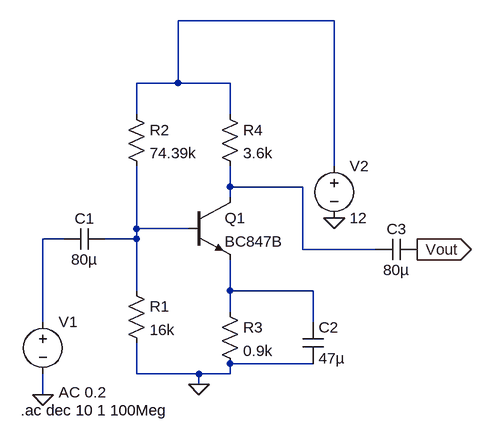
[diagram p0: schematic exp-5electro.asc]
exp-5electro.asc, the LTspice schematic file:
Version 4
SHEET 1 880 680
WIRE 432 -240 192 -240
WIRE 192 -144 192 -240
WIRE 192 -144 128 -144
WIRE 272 -144 192 -144
WIRE 128 -96 128 -144
WIRE 272 -96 272 -144
WIRE 432 -16 432 -240
WIRE 272 16 272 -16
WIRE 384 16 272 16
WIRE 272 32 272 16
WIRE 128 80 128 -16
WIRE 208 80 128 80
WIRE 16 96 -16 96
WIRE 128 96 128 80
WIRE 128 96 80 96
WIRE 384 112 384 16
WIRE 496 112 384 112
WIRE 128 176 128 96
WIRE 272 176 272 128
WIRE 400 176 272 176
WIRE 272 208 272 176
WIRE -16 224 -16 96
WIRE 400 224 400 176
WIRE 400 288 272 288
WIRE 128 304 128 256
WIRE 224 304 128 304
WIRE 272 304 272 288
WIRE 272 304 224 304
WIRE 224 320 224 304
WIRE -16 336 -16 304
FLAG 224 320 0
FLAG -16 336 0
FLAG 560 112 Vout
IOPIN 560 112 Out
FLAG 432 64 0
SYMBOL res 112 160 R0
SYMATTR InstName R1
SYMATTR Value 16k
SYMBOL res 112 -112 R0
SYMATTR InstName R2
SYMATTR Value 74.39k
SYMBOL res 256 192 R0
SYMATTR InstName R3
SYMATTR Value 0.9k
SYMBOL cap 384 224 R0
SYMATTR InstName C2
SYMATTR Value 47µ
SYMBOL res 256 -112 R0
SYMATTR InstName R4
SYMATTR Value 3.6k
SYMBOL voltage 432 -32 R0
WINDOW 123 0 0 Left 0
WINDOW 39 0 0 Left 0
SYMATTR InstName V2
SYMATTR Value 12
SYMBOL cap 560 96 R90
WINDOW 0 0 32 VBottom 2
WINDOW 3 32 32 VTop 2
SYMATTR InstName C3
SYMATTR Value 80µ
SYMBOL npn 208 32 R0
SYMATTR InstName Q1
SYMATTR Value BC847B
SYMBOL voltage -16 208 R0
WINDOW 123 24 124 Left 2
WINDOW 39 0 0 Left 0
SYMATTR InstName V1
SYMATTR Value ""
SYMATTR Value2 AC 0.2
SYMBOL cap 80 80 R90
WINDOW 0 0 32 VBottom 2
WINDOW 3 32 32 VTop 2
SYMATTR InstName C1
SYMATTR Value 80µ
TEXT -50 360 Left 2 !.ac dec 10 1 100Meg

The netlist it stands for:
* exp-5electro.asc
R1 N003 0 16k
R2 N001 N003 74.39k
R3 N005 0 0.9k
C2 N005 0 47µ
R4 N001 N002 3.6k
V2 N001 0 12
C3 Vout N002 80µ
Q1 N002 N003 N005 0 BC847B
V1 N004 0 AC 0.2
C1 N003 N004 80µ
.model NPN NPN
.model PNP PNP
.lib standard.bjt
.ac dec 10 1 100Meg
.backanno
.end